# Altium project OMAPL-Extrention Prototype.PrjPcb
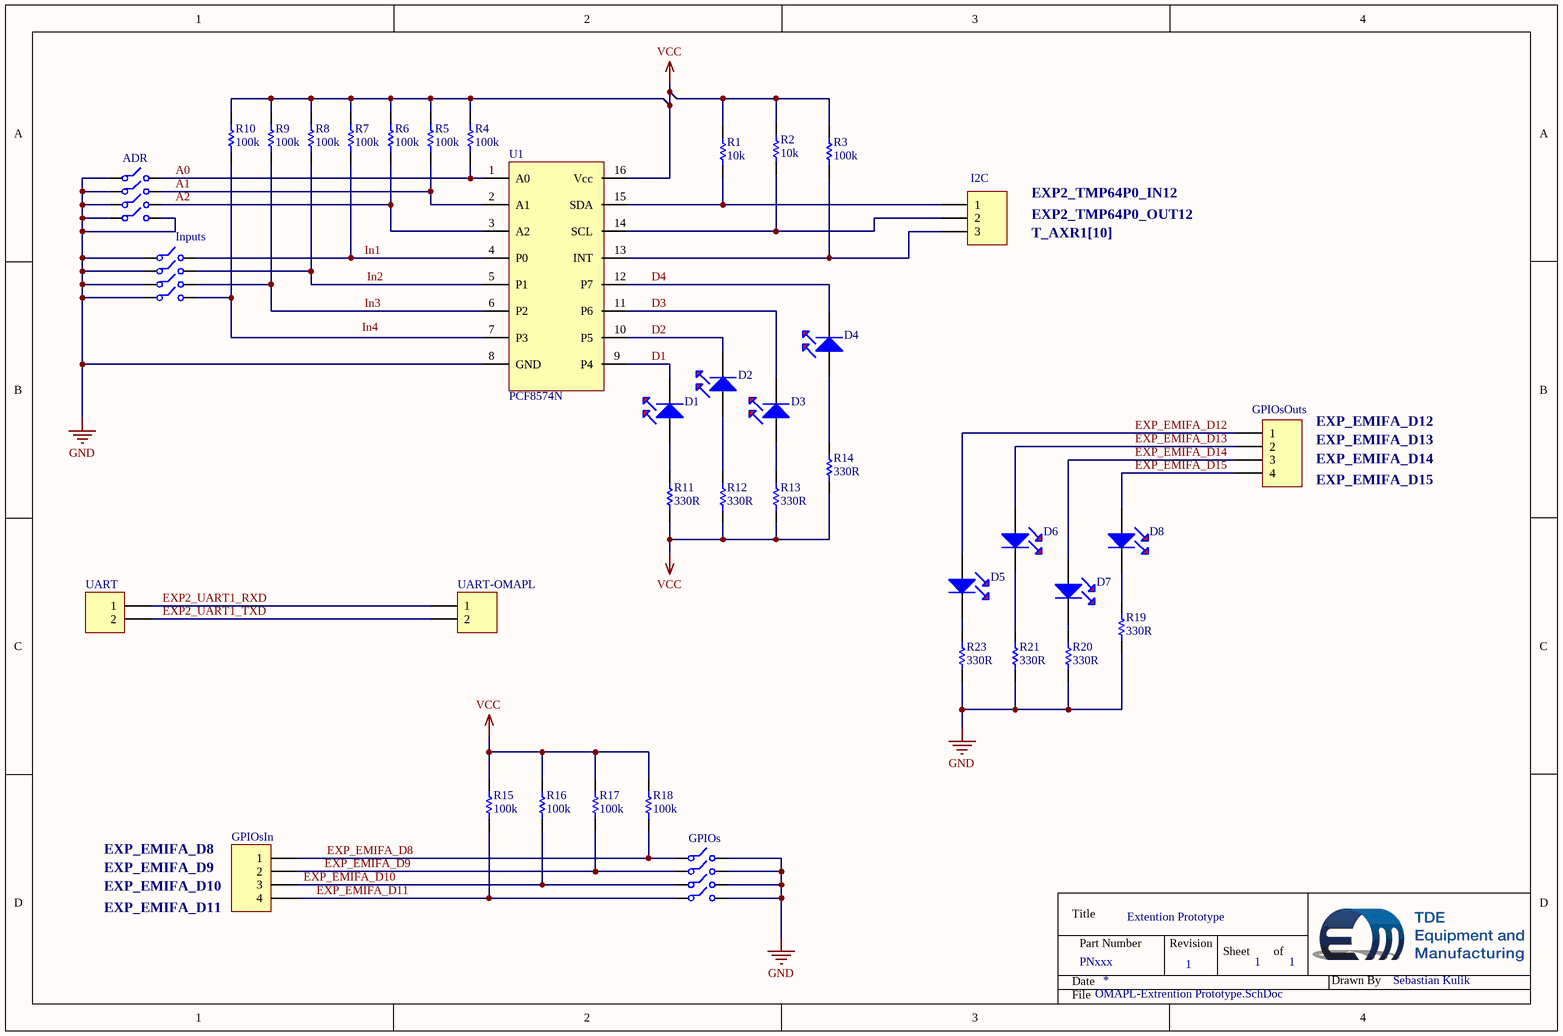
[diagram p0: OMAPL-Extrention Prototype.SchDoc]
1 sheet, 39 parts. Net scope: global (net labels, ports and power ports of the same name join across sheets).
Board file: OMAPL-Extrention Prototype.PcbDoc

## Sheet OMAPL-Extrention Prototype.SchDoc: Extention Prototype
size A4; Revision: 1; SheetNumber: 1; SheetTotal: 1; PartNumber: PNxxx; Drawn By: Sebastian Kulik

### Parts
ADR  WS-DITV-4DIP  [DIP-8-Ceramic-HT]  (value not drawn)
D1  151051RS11000  [LED2X5]  (value not drawn)
D2  151051RS11000  [LED2X5]  (value not drawn)
D3  151051RS11000  [LED2X5]  (value not drawn)
D4  151051RS11000  [LED2X5]  (value not drawn)
D5  151051RS11000  [LED2X5]  (value not drawn)
D6  151051RS11000  [LED2X5]  (value not drawn)
D7  151051RS11000  [LED2X5]  (value not drawn)
D8  151051RS11000  [LED2X5]  (value not drawn)
GPIOs  WS-DITV-4DIP  [DIP-8-Ceramic-HT]  (value not drawn)
GPIOsIn  Plug_4_90_2.54  [HDR1X4]  (value not drawn)
GPIOsOuts  Plug_4_90_2.54  [HDR1X4]  (value not drawn)
I2C  Plug_3_90_2.54  [HDR1X3]  (value not drawn)
Inputs  WS-DITV-4DIP  [DIP-8-Ceramic-HT]  (value not drawn)
R1  value 10k  [Dummy-10mm]  (hidden comment: Resistor-Dummy-THT)
R2  value 10k  [Dummy-10mm]  (hidden comment: Resistor-Dummy-THT)
R3  value 100k  [Dummy-10mm]  (hidden comment: Resistor-Dummy-THT)
R4  value 100k  [Dummy-10mm]  (hidden comment: Resistor-Dummy-THT)
R5  value 100k  [Dummy-10mm]  (hidden comment: Resistor-Dummy-THT)
R6  value 100k  [Dummy-10mm]  (hidden comment: Resistor-Dummy-THT)
R7  value 100k  [Dummy-10mm]  (hidden comment: Resistor-Dummy-THT)
R8  value 100k  [Dummy-10mm]  (hidden comment: Resistor-Dummy-THT)
R9  value 100k  [Dummy-10mm]  (hidden comment: Resistor-Dummy-THT)
R10  value 100k  [Dummy-10mm]  (hidden comment: Resistor-Dummy-THT)
R11  value 330R  [Dummy-10mm]  (hidden comment: Resistor-Dummy-THT)
R12  value 330R  [Dummy-10mm]  (hidden comment: Resistor-Dummy-THT)
R13  value 330R  [Dummy-10mm]  (hidden comment: Resistor-Dummy-THT)
R14  value 330R  [Dummy-10mm]  (hidden comment: Resistor-Dummy-THT)
R15  value 100k  [Dummy-10mm]  (hidden comment: Resistor-Dummy-THT)
R16  value 100k  [Dummy-10mm]  (hidden comment: Resistor-Dummy-THT)
R17  value 100k  [Dummy-10mm]  (hidden comment: Resistor-Dummy-THT)
R18  value 100k  [Dummy-10mm]  (hidden comment: Resistor-Dummy-THT)
R19  value 330R  [Dummy-10mm]  (hidden comment: Resistor-Dummy-THT)
R20  value 330R  [Dummy-10mm]  (hidden comment: Resistor-Dummy-THT)
R21  value 330R  [Dummy-10mm]  (hidden comment: Resistor-Dummy-THT)
R23  value 330R  [Dummy-10mm]  (hidden comment: Resistor-Dummy-THT)
U1  PCF8574N  [DIP-16]
UART  Plug_2_90_2.54  [HDR1X2]  (value not drawn)
UART-OMAPL  Plug_2_90_2.54  [HDR1X2]  (value not drawn)

### Nets
GND: ADR.1 ADR.2 ADR.3 ADR.4 ADR.5 GPIOs.5 GPIOs.6 GPIOs.7 GPIOs.8 Inputs.1 Inputs.2 Inputs.3 Inputs.4 R19.1 R20.1 R21.1 R23.1 U1.8(GND)
VCC: R1.2 R2.2 R3.2 R4.2 R5.2 R6.2 R7.2 R8.2 R9.2 R10.2 R11.1 R12.1 R13.1 R14.1 R15.2 R16.2 R17.2 R18.2 U1.16(Vcc)
A0: ADR.8 R4.1 U1.1(A0)
A1: ADR.7 R5.1 U1.2(A1)
A2: ADR.6 R6.1 U1.3(A2)
D1: D1.K U1.9(P4)
D2: D2.K U1.10(P5)
D3: D3.K U1.11(P6)
D4: D4.K U1.12(P7)
EXP2_UART1_RXD: UART.1 UART-OMAPL.1
EXP2_UART1_TXD: UART.2 UART-OMAPL.2
EXP_EMIFA_D8: GPIOs.1 GPIOsIn.1 R18.1
EXP_EMIFA_D9: GPIOs.2 GPIOsIn.2 R17.1
EXP_EMIFA_D10: GPIOs.3 GPIOsIn.3 R16.1
EXP_EMIFA_D11: GPIOs.4 GPIOsIn.4 R15.1
EXP_EMIFA_D12: D5.A GPIOsOuts.1
EXP_EMIFA_D13: D6.A GPIOsOuts.2
EXP_EMIFA_D14: D7.A GPIOsOuts.3
EXP_EMIFA_D15: D8.A GPIOsOuts.4
In1: Inputs.8 R7.1 U1.4(P0)
In2: Inputs.7 R8.1 U1.5(P1)
In3: Inputs.6 R9.1 U1.6(P2)
NetD1_A: D1.A R11.2
NetD2_A: D2.A R12.2
NetD3_A: D3.A R13.2
NetD4_A: D4.A R14.2
NetD5_K: D5.K R23.2
NetD6_K: D6.K R21.2
NetD7_K: D7.K R20.2
NetD8_K: D8.K R19.2
NetI2C_1: I2C.1 R1.1 U1.15(SDA)
NetI2C_2: I2C.2 R2.1 U1.14(SCL)
NetI2C_3: I2C.3 R3.1 U1.13(INT)
NetInputs_5: Inputs.5 R10.1 U1.7(P3)

### Notes on the sheet
- EXP2_TMP64P0_OUT12
- EXP2_TMP64P0_IN12
- T_AXR1[10]
- (near GPIOsOuts) EXP_EMIFA_D13
- (near GPIOsOuts) EXP_EMIFA_D12
- (near GPIOsOuts) EXP_EMIFA_D15
- (near GPIOsOuts) EXP_EMIFA_D14
- EXP_EMIFA_D8
- EXP_EMIFA_D11
- EXP_EMIFA_D10
- EXP_EMIFA_D9
- Labels drawn without touching a wire or pin: In4
- Title
- Date
- Part Number
- Revision
- Sheet
- of
- Drawn By
- File

### Library data of the parts
ADR GPIOs Inputs = WS-DITV-4DIP: 4 way DIP switch; Deliverer PartNr: 418127270904; Deliverer: WE; TDFE-PN: M0015; Published: 20.07.2016; Publisher: Sebastian Kulik; PackageDescription: DIP-8; Manufacturer: WE; Manufacturer PartNr: 418127270904; Value: WS-DITV-4DIP
D1-D8 = 151051RS11000: LED, 5mm, red, THT; TDE-PN: DIS0029; Deliverer: WE; Published: 04.11.2014; Publisher: Sebastian Kulik; PackageDescription: LED2X5; Manufacturer PartNr: 151051RS11000; Deliverer PartNr: 151051RS11000; Manufacturer: WE
GPIOsIn GPIOsOuts = Plug_4_90_2.54: Plug, 4-Pin; Manufacturer PartNr: 613 004 111 21; Manufacturer: WE; TDE-PN: CON0033; LatestRevisionDate: 06.11.2014; LatestRevisionNote: Re-released for DXP Platform.; Publisher: Sebastian Kulik; Deliverer: WE; Deliverer PartNr: 613 004 111 21
I2C = Plug_3_90_2.54: Plug,-3-Pin; Manufacturer: WE; Manufacturer PartNr: 61300311021; Deliverer PartNr: 828-1585; Deliverer: RS; TDE-PN: CON0011; Publisher: Sebastian Kulik; Price: 0.138/5
R1 R2 = Resistor-Dummy-THT: Deliverer PartNr: 148-736; Deliverer: RS; Published: 08.12.2015; Publisher: Sebastian Kulik; PackageDescription: -; Manufacturer: -; Manufacturer PartNr: -; TDE-PN: -; Part Desicription: Resistor-Dummy-THT; Price: 0.027/10
R3-R10 R15-R18 = Resistor-Dummy-THT: Deliverer PartNr: 148-972; Deliverer: RS; Published: 08.12.2015; Publisher: Sebastian Kulik; PackageDescription: -; Manufacturer: -; Manufacturer PartNr: -; TDE-PN: -; Part Desicription: Resistor-Dummy-THT; Price: 0.027/10
R11-R14 R19-R21 R23 = Resistor-Dummy-THT: Deliverer PartNr: 148-382; Deliverer: RS; Published: 08.12.2015; Publisher: Sebastian Kulik; PackageDescription: -; Manufacturer: -; Manufacturer PartNr: -; TDE-PN: -; Part Desicription: Resistor-Dummy-THT; Price: 0.058/10
U1 = PCF8574N: I2C 8-bit expander; Deliverer PartNr: 517-0687; Manufacturer: TI; Deliverer: RS; TDE-PN: IC0079; Published: 18.07.2016; PackageDescription: DIP16; Publisher: Sebastian Kulik; Manufacturer PartNr: PCF8574N; Price: 1.34/5
UART UART-OMAPL = Plug_2_90_2.54: Plug, 2-Pin; Manufacturer PartNr: 61300211021; Manufacturer: WE; Deliverer PartNr: 2356176; Deliverer: Farnell; TDE-PN: CON0010; LatestRevisionDate: 14.05.2014; LatestRevisionNote: Re-released for DXP Platform.; Publisher: Sebastian Kulik